# Altium schematic sheet Motor_Driver.SchDoc: Motor Driver
size A4; DrawnBy: wgl18; Organization: ENEL429 Group 9; Address1: ECE Department; Address2: University of Canterbury; Address3: Christchurch 8041; Address4: New Zealand; Revision: 1; SheetNumber: 4; SheetTotal: 5
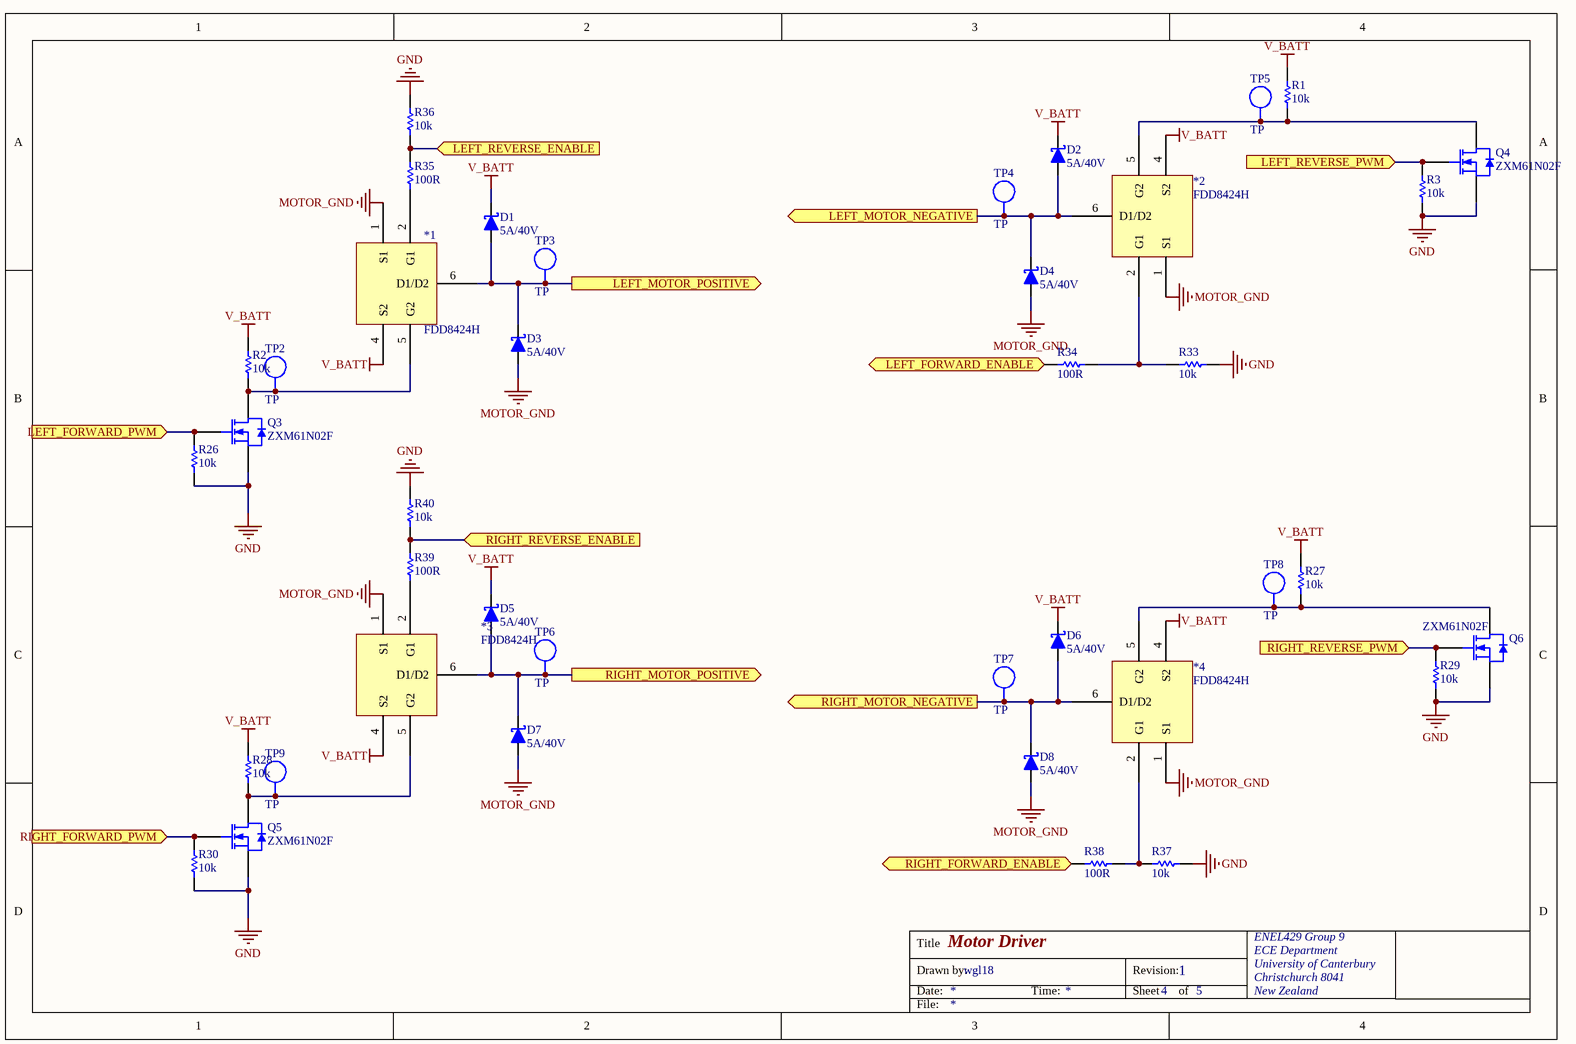
[diagram p0: Motor_Driver.SchDoc]

## Parts
*1  FDD8424H  [TO114P990X239-5N]
*2  FDD8424H  [TO114P990X239-5N]
*3  FDD8424H  [TO114P990X239-5N]
*4  FDD8424H  [TO114P990X239-5N]
D1  5A/40V  [DIODE_SMC]
D2  5A/40V  [DIODE_SMC]
D3  5A/40V  [DIODE_SMC]
D4  5A/40V  [DIODE_SMC]
D5  5A/40V  [DIODE_SMC]
D6  5A/40V  [DIODE_SMC]
D7  5A/40V  [DIODE_SMC]
D8  5A/40V  [DIODE_SMC]
Q3  ZXM61N02F  [SOT-23]
Q4  ZXM61N02F  [SOT-23]
Q5  ZXM61N02F  [SOT-23]
Q6  ZXM61N02F  [SOT-23]
R1  10k  [0603]
R2  10k  [0603]
R3  10k  [0603]
R26  10k  [0603]
R27  10k  [0603]
R28  10k  [0603]
R29  10k  [0603]
R30  10k  [0603]
R33  10k  [0603]
R34  100R  [0603]
R35  100R  [0603]
R36  10k  [0603]
R37  10k  [0603]
R38  100R  [0603]
R39  100R  [0603]
R40  10k  [0603]
TP2  TP  [TEST_POINT_4X2MM]  (no BOM)
TP3  TP  [TEST_POINT_4X2MM]  (no BOM)
TP4  TP  [TEST_POINT_4X2MM]  (no BOM)
TP5  TP  [TEST_POINT_4X2MM]  (no BOM)
TP6  TP  [TEST_POINT_4X2MM]  (no BOM)
TP7  TP  [TEST_POINT_4X2MM]  (no BOM)
TP8  TP  [TEST_POINT_4X2MM]  (no BOM)
TP9  TP  [TEST_POINT_4X2MM]  (no BOM)

## Ports
LEFT_FORWARD_ENABLE (in), LEFT_FORWARD_PWM (in), LEFT_MOTOR_NEGATIVE (out), LEFT_MOTOR_POSITIVE (out), LEFT_REVERSE_ENABLE (in), LEFT_REVERSE_PWM (in), RIGHT_FORWARD_ENABLE (in), RIGHT_FORWARD_PWM (in), RIGHT_MOTOR_NEGATIVE (out), RIGHT_MOTOR_POSITIVE (out), RIGHT_REVERSE_ENABLE (in), RIGHT_REVERSE_PWM (in)

## Nets
GND: Q3.2(S) Q4.2(S) Q5.2(S) Q6.2(S) R3.1 R26.2 R29.1 R30.2 R33.2 R36.1 R37.2 R40.1
MOTOR_GND: *1.1(S1) *2.1(S1) *3.1(S1) *4.1(S1) D3.1(A) D4.1(A) D7.1(A) D8.1(A)
V_BATT: *1.4(S2) *2.4(S2) *3.4(S2) *4.4(S2) D1.2(K) D2.2(K) D5.2(K) D6.2(K) R1.2 R2.1 R27.2 R28.1
LEFT_FORWARD_ENABLE: R34.1 ; port LEFT_FORWARD_ENABLE
LEFT_FORWARD_PWM: Q3.1(G) R26.1 ; port LEFT_FORWARD_PWM
LEFT_MOTOR_NEGATIVE: *2.6(D1/D2) D2.1(A) D4.2(K) TP4.1 ; port LEFT_MOTOR_NEGATIVE
LEFT_MOTOR_POSITIVE: *1.6(D1/D2) D1.1(A) D3.2(K) TP3.1 ; port LEFT_MOTOR_POSITIVE
LEFT_REVERSE_ENABLE: R35.2 R36.2 ; port LEFT_REVERSE_ENABLE
LEFT_REVERSE_PWM: Q4.1(G) R3.2 ; port LEFT_REVERSE_PWM
RIGHT_FORWARD_ENABLE: R38.1 ; port RIGHT_FORWARD_ENABLE
RIGHT_FORWARD_PWM: Q5.1(G) R30.1 ; port RIGHT_FORWARD_PWM
RIGHT_MOTOR_NEGATIVE: *4.6(D1/D2) D6.1(A) D8.2(K) TP7.1 ; port RIGHT_MOTOR_NEGATIVE
RIGHT_MOTOR_POSITIVE: *3.6(D1/D2) D5.1(A) D7.2(K) TP6.1 ; port RIGHT_MOTOR_POSITIVE
RIGHT_REVERSE_ENABLE: R39.2 R40.2 ; port RIGHT_REVERSE_ENABLE
RIGHT_REVERSE_PWM: Q6.1(G) R29.2 ; port RIGHT_REVERSE_PWM
Net*1_2: *1.2(G1) R35.1
Net*1_5: *1.5(G2) Q3.3(D) R2.2 TP2.1
Net*2_2: *2.2(G1) R33.1 R34.2
Net*2_5: *2.5(G2) Q4.3(D) R1.1 TP5.1
Net*3_2: *3.2(G1) R39.1
Net*3_5: *3.5(G2) Q5.3(D) R28.2 TP9.1
Net*4_2: *4.2(G1) R37.1 R38.2
Net*4_5: *4.5(G2) Q6.3(D) R27.1 TP8.1

Not connected (* = marked no-connect by the designer): *1 3(DNC); *2 3(DNC); *3 3(DNC); *4 3(DNC)

## Notes on the sheet
- Title
- Drawn by:
- Date:
- Time:
- Revision:
- Sheet
- of
- File:

## Library data of the parts
*1-*4 = FDD8424H: Manufacturer: Fairchild Semiconductor; Supplier 1: Digikey; Manufacturer PN: FDD8424H; Supplier Part Number 1: FDD8424HCT-ND
D1-D8 = DS_SSC54-E3/57T: DIODE SCHOTTKY 5A 40V SMC; Manufacturer: Vishay; Verify: Not Checked; Value: 5A/40V; Part Number: DS_SSC54-E3/57T; Component Kind: Standard; Component Type: Standard; Designator: DS_SSC54-E3/57T; Pin Count: 2; LatestRevisionDate: 2 Mar 09; Manufacturer PN: SSC54-E3/57T; Supplier 1: Digi-Key; Supplier Part Number 1: SSC54-E3/57TGICT-ND
Q3-Q6 = TF_ZXM61N02F: 20V N-channel enhancement mode MOSFET; Manufacturer: Zetex; Supplier 1: Element 14; Supplier Part Number 1: 9525270; price: 1.28; Supplier 2: Digi-Key; Supplier Part Number 2: ZXM61N02FCT-ND; value: ZXM61N02F; Part Number: TF_ZXM61N02F; Component Kind: Standard; Component Type: Standard; Designator: TF_ZXM61N02F; Pin Count: 3; PCB3D: sot23
R1-R3 R26-R30 R33 R36 R37 R40 = RS_10k 0603: RES 10.0K OHM 1/10W 1% 0603 SMD; Manufacturer: Yageo; Manufacturer PN: RC0603FR-0710KL; LatestRevisionDate: 29 May 08; Supplier 1: Digi-Key; Supplier Part Number 1: 311-10.0KHRTR-ND; Value: 10k; Part Number: RS_10k 0603; Component Kind: Standard; Component Type: Standard; Designator: RS_10k 0603; Pin Count: 2; Signal Integrity: Res; Simulation: RESISTOR
R34 R35 R38 R39 = RS_100R 0603: RES 100 OHM 1/10W 1% 0603 SMD; Manufacturer: ROHM; Manufacturer PN: MCR03EZPFX1000; LatestRevisionDate: n/a; Supplier 1: Digi-Key; Supplier Part Number 1: RHM100HTR-ND; Value: 100R; Part Number: RS_100R 0603; Component Kind: Standard; Component Type: Standard; Designator: RS_100R 0603; Pin Count: 2; Signal Integrity: Res; Simulation: RESISTOR
TP2-TP9 = TP_TESTPOINT: Test-Point; Value: TP; Part Number: TP_TESTPOINT; LatestRevisionDate: 29 May 08; Manufacturer PN: *; Manufacturer: *; Supplier 1: Digi-Key; Supplier Part Number 1: 5016KTR-ND; Component Type: Standard (No BOM); Designator: TP_TESTPOINT; Pin Count: 1